# Altium schematic sheet Connectors.SchDoc
size A4; DocumentNumber: 4; SheetNumber: 4; SheetTotal: 4
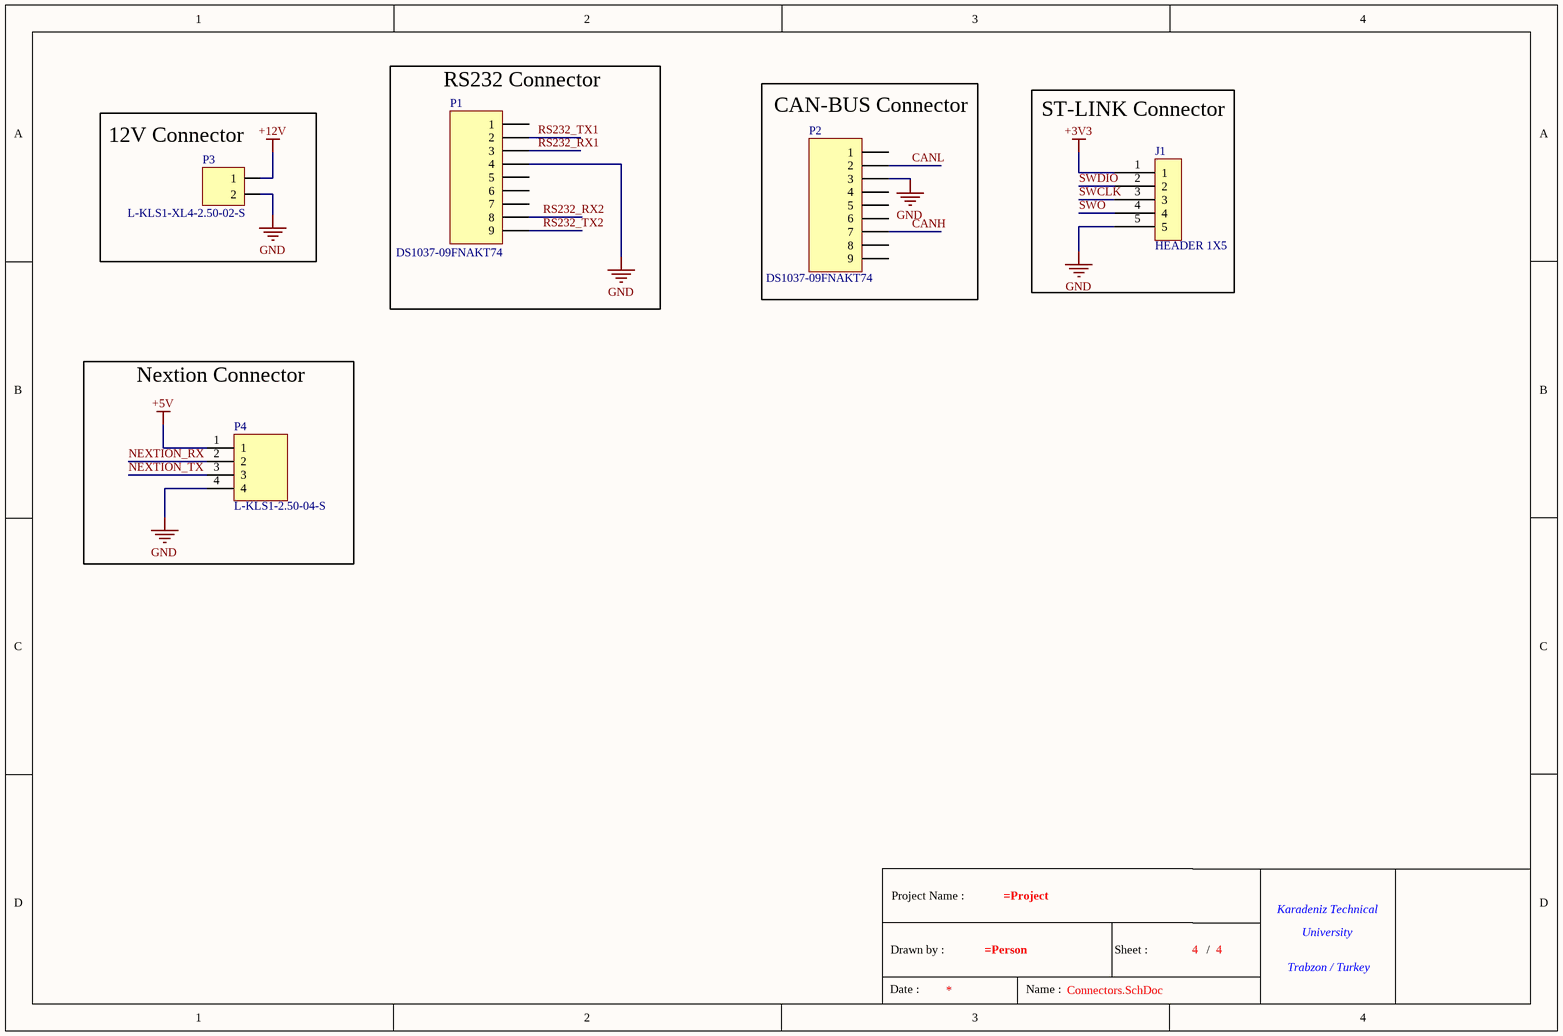
[diagram p0: Connectors.SchDoc]

## Parts
*  Title Block  (value not drawn)  (graphical)
J1  HEADER 1X5  [Header 2.54 1x5]
P1  DS1037-09FNAKT74  [D SUB 9PIN FEMALE 90C TH]
P2  DS1037-09FNAKT74  [D SUB 9PIN FEMALE 90C TH]
P3  L-KLS1-XL4-2.50-02-S  [2 PIN MALE 180C TH 2.50MM]
P4  L-KLS1-2.50-04-S  [1x4 TUNIC CONNECTOR]

## Blocks framed on the sheet
RS232 Connector: P1
CAN-BUS Connector: P2
12V Connector: P3
ST-LINK Connector: J1
Nextion Connector: P4

## Nets
+3V3: J1.1
+5V: P4.1
+12V: P3.1
GND: J1.5 P1.4 P2.3 P3.2 P4.4
CANH: P2.7
CANL: P2.2
NEXTION_RX: P4.2
NEXTION_TX: P4.3
RS232_RX1: P1.3
RS232_RX2: P1.8
RS232_TX1: P1.2
RS232_TX2: P1.9
SWCLK: J1.3
SWDIO: J1.2
SWO: J1.4

Not connected (* = marked no-connect by the designer): P1 1 5 6 7; P2 1 4 5 6 8 9

## Notes on the sheet
- (in symbol Title Block) Project Name :; Karadeniz Technical; University; Drawn by :; Sheet :; /; Trabzon / Turkey; Date :; Name :

## Library data of the parts
* = Title Block: Standart Title Block
J1 = HEADER 1X5: 2.54mm 1x5 Header
P1 P2 = DS1037-09FNAKT74: Manufacturer: CONNFLY; Library Reference: Connector; Mating Connector: L-KLS1-213-09-M-L; Gender: Female; Contact Number: 9; Number of Row: 2; Mounting Angle: 90; Current(max): 1.5A; Contact Resistance(max): 20mohm; Pitch: 2.77mm; Man Code: DS1037-09FNAKT74; Component Type: D SUB 9 PIN Female Connector; Mounting Style: Through Hole
P3 = L-KLS1-XL4-2.50-02-S: Manufacturer: KLS ELECTRONIC; Contact Number: 3; Contact Resistance (Max): 10mohm; Current(Max): 3A; Gender: Male; Mounting Angle: 180; Number of Row: 1; Pitch: 2.50mm; Component Type: CONN 2PIN MALE 180C TH 2.5mm; Mounting Style: THT; Man Code: L-KLS1-XL4-2.50-02-S
P4 = L-KLS1-2.50-04-S: Manufacturer: KLS ELECTRONIC; Comopnent Type: Connector; Gender: Male; Pitch: 2.50mm; Man Code: L-KLS1-2.50-04-S; Mounting Type: THT; Number of pins: 4; Number of rows: 1